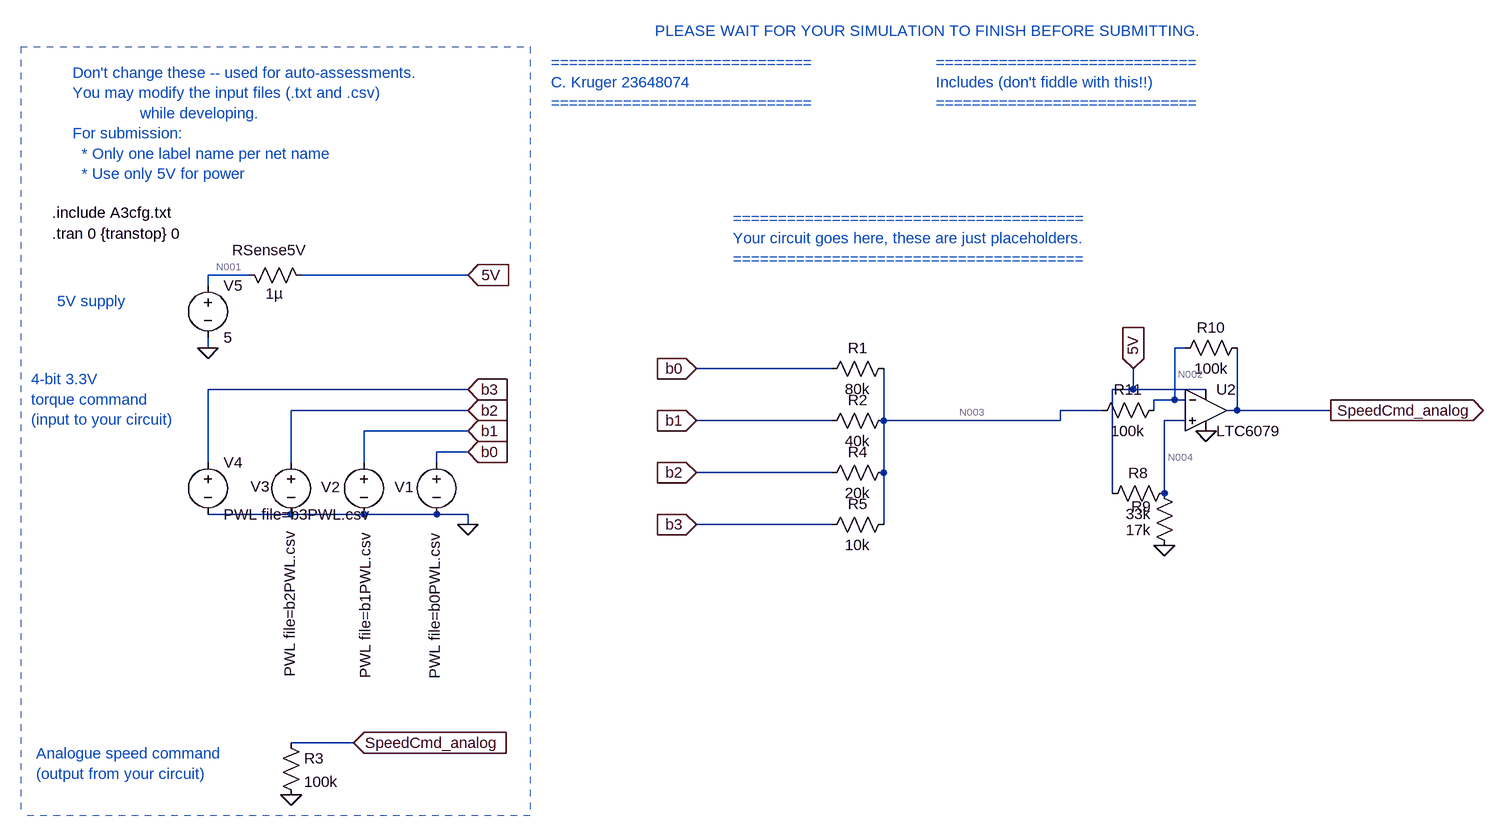
[diagram p0: schematic E344_23648074_A3.asc]
E344_23648074_A3.asc, the LTspice schematic file:
Version 4
SHEET 1 1824 2192
WIRE -2016 -1072 -2080 -1072
WIRE -1680 -1072 -1936 -1072
WIRE -2080 -1056 -2080 -1072
WIRE -2080 -960 -2080 -976
WIRE -576 -960 -592 -960
WIRE -1120 -928 -1328 -928
WIRE -1680 -896 -2080 -896
WIRE -656 -896 -656 -928
WIRE -656 -896 -688 -896
WIRE -544 -896 -656 -896
WIRE -592 -880 -592 -960
WIRE -592 -880 -624 -880
WIRE -576 -880 -592 -880
WIRE -1680 -864 -1952 -864
WIRE -704 -864 -768 -864
WIRE -624 -864 -624 -880
WIRE -496 -864 -496 -960
WIRE -496 -864 -512 -864
WIRE -352 -864 -496 -864
WIRE -1120 -848 -1328 -848
WIRE -1040 -848 -1040 -928
WIRE -768 -848 -768 -864
WIRE -768 -848 -1040 -848
WIRE -576 -848 -608 -848
WIRE -1680 -832 -1840 -832
WIRE -1680 -800 -1728 -800
WIRE -2080 -784 -2080 -896
WIRE -1952 -784 -1952 -864
WIRE -1840 -784 -1840 -832
WIRE -1728 -784 -1728 -800
WIRE -1120 -768 -1328 -768
WIRE -1040 -768 -1040 -848
WIRE -688 -736 -688 -896
WIRE -608 -736 -608 -848
WIRE -1952 -704 -2080 -704
WIRE -1840 -704 -1952 -704
WIRE -1728 -704 -1840 -704
WIRE -1680 -704 -1728 -704
WIRE -1680 -688 -1680 -704
WIRE -1120 -688 -1328 -688
WIRE -1040 -688 -1040 -768
WIRE -1856 -352 -1952 -352
FLAG -1680 -1072 5V
IOPIN -1680 -1072 In
FLAG -2080 -960 0
FLAG -656 -928 5V
IOPIN -656 -928 In
FLAG -352 -864 SpeedCmd_analog
IOPIN -352 -864 Out
FLAG -1680 -688 0
FLAG -1680 -896 b3
IOPIN -1680 -896 In
FLAG -1680 -864 b2
IOPIN -1680 -864 In
FLAG -1680 -832 b1
IOPIN -1680 -832 In
FLAG -1680 -800 b0
IOPIN -1680 -800 In
FLAG -1328 -688 b3
IOPIN -1328 -688 In
FLAG -1328 -768 b2
IOPIN -1328 -768 In
FLAG -1328 -848 b1
IOPIN -1328 -848 In
FLAG -1328 -928 b0
IOPIN -1328 -928 In
FLAG -1856 -352 SpeedCmd_analog
IOPIN -1856 -352 In
FLAG -1952 -272 0
FLAG -544 -832 0
FLAG -608 -656 0
SYMBOL voltage -2080 -1072 R0
WINDOW 123 0 0 Left 0
WINDOW 39 0 0 Left 0
SYMATTR InstName V5
SYMATTR Value 5
SYMBOL res -2032 -1088 M90
WINDOW 0 -7 47 VBottom 2
WINDOW 3 29 54 VTop 2
SYMATTR InstName RSense5V
SYMATTR Value 1µ
SYMBOL voltage -1728 -800 R0
WINDOW 3 -3 125 VRight 2
WINDOW 123 0 0 Left 0
WINDOW 39 0 0 Left 0
WINDOW 0 -65 54 Left 2
SYMATTR Value PWL file=b0PWL.csv
SYMATTR InstName V1
SYMBOL voltage -1840 -800 R0
WINDOW 3 2 124 VRight 2
WINDOW 123 0 0 Left 0
WINDOW 39 0 0 Left 0
WINDOW 0 -66 54 Left 2
SYMATTR Value PWL file=b1PWL.csv
SYMATTR InstName V2
SYMBOL voltage -1952 -800 R0
WINDOW 3 -2 122 VRight 2
WINDOW 123 0 0 Left 0
WINDOW 39 0 0 Left 0
WINDOW 0 -62 53 Left 2
SYMATTR Value PWL file=b2PWL.csv
SYMATTR InstName V3
SYMBOL res -1968 -368 R0
SYMATTR InstName R3
SYMATTR Value 100k
SYMBOL res -1024 -944 R90
WINDOW 0 0 56 VBottom 2
WINDOW 3 32 56 VTop 2
SYMATTR InstName R1
SYMATTR Value 80k
SYMBOL res -1024 -864 R90
WINDOW 0 0 56 VBottom 2
WINDOW 3 32 56 VTop 2
SYMATTR InstName R2
SYMATTR Value 40k
SYMBOL res -1024 -784 R90
WINDOW 0 0 56 VBottom 2
WINDOW 3 32 56 VTop 2
SYMATTR InstName R4
SYMATTR Value 20k
SYMBOL res -1024 -704 R90
WINDOW 0 0 56 VBottom 2
WINDOW 3 32 56 VTop 2
SYMATTR InstName R5
SYMATTR Value 10k
SYMBOL OpAmps\\LTC6079 -544 -864 R0
SYMATTR InstName U2
SYMBOL res -592 -752 R90
WINDOW 0 0 56 VBottom 2
WINDOW 3 32 56 VTop 2
SYMATTR InstName R8
SYMATTR Value 33k
SYMBOL res -592 -640 R180
WINDOW 0 36 76 Left 2
WINDOW 3 36 40 Left 2
SYMATTR InstName R9
SYMATTR Value 17k
SYMBOL res -480 -976 R90
WINDOW 0 0 56 VBottom 2
WINDOW 3 32 56 VTop 2
SYMATTR InstName R10
SYMATTR Value 100k
SYMBOL res -608 -880 R90
WINDOW 0 0 56 VBottom 2
WINDOW 3 32 56 VTop 2
SYMATTR InstName R11
SYMATTR Value 100k
SYMBOL voltage -2080 -800 R0
WINDOW 123 0 0 Left 0
WINDOW 39 0 0 Left 0
SYMATTR InstName V4
SYMATTR Value PWL file=b3PWL.csv
TEXT -2288 -1384 Left 2 ;Don't change these -- used for auto-assessments.\nYou may modify the input files (.txt and .csv) \n               while developing.\nFor submission: \n  * Only one label name per net name\n  * Use only 5V for power
TEXT -1552 -1400 Left 2 ;=============================\nC. Kruger 23648074\n=============================
TEXT -960 -1400 Left 2 ;=============================\nIncludes (don't fiddle with this!!)\n=============================
TEXT -1272 -1160 Left 2 ;=======================================\nYour circuit goes here, these are just placeholders.\n=======================================
TEXT -1392 -1448 Left 2 ;PLEASE WAIT FOR YOUR SIMULATION TO FINISH BEFORE SUBMITTING.
TEXT -2320 -1136 Left 2 !.tran 0 {transtop} 0
TEXT -2320 -1168 Left 2 !.include A3cfg.txt
TEXT -2312 -1032 Left 2 ;5V supply
TEXT -2352 -912 Left 2 ;4-bit 3.3V\ntorque command\n(input to your circuit)
TEXT -2344 -336 Left 2 ;Analogue speed command\n(output from your circuit)
LINE Normal -1584 -1424 -1584 -240 2
LINE Normal -2368 -1424 -1584 -1424 2
LINE Normal -1584 -240 -2368 -240 2
LINE Normal -1584 -256 -1584 -256 2
LINE Normal -2368 -1424 -2368 -240 2

The netlist it stands for:
* E344_23648074_A3.asc
V5 N001 0 5
RSense5V N001 5V 1µ
V1 b0 0 PWL file=b0PWL.csv
V2 b1 0 PWL file=b1PWL.csv
V3 b2 0 PWL file=b2PWL.csv
R3 SpeedCmd_analog 0 100k
R1 N003 b0 80k
R2 N003 b1 40k
R4 N003 b2 20k
R5 N003 b3 10k
XU2 N004 N002 5V 0 SpeedCmd_analog LTC6078  ; LTC6079, pins In+ In- V+ V- OUT
R8 N004 5V 33k
R9 0 N004 17k
R10 SpeedCmd_analog N002 100k
R11 N002 N003 100k
V4 b3 0 PWL file=b3PWL.csv
* Don't change these -- used for auto-assessments.
* You may modify the input files (.txt and .csv)
*                while developing.
* For submission:
*   * Only one label name per net name
*   * Use only 5V for power
* =============================
* C. Kruger 23648074
* =============================
* =============================
* Includes (don't fiddle with this!!)
* =============================
* =======================================
* Your circuit goes here, these are just placeholders.
* =======================================
* PLEASE WAIT FOR YOUR SIMULATION TO FINISH BEFORE SUBMITTING.
.tran 0 {transtop} 0
.include A3cfg.txt
* 5V supply
* 4-bit 3.3V
* torque command
* (input to your circuit)
* Analogue speed command
* (output from your circuit)
.lib LTC5.lib
.backanno
.end

* Results of the author's LTspice run, read from the files saved beside the schematic
* Operating Point, zero values left out:
*   V(n001) = 5 V
*   V(5v) = 5 V
*   V(speedcmd_analog) = 3.314 V
*   V(n003) = 86.08 mV
*   V(n004) = 1.7 V
*   V(n002) = 1.7 V
*   I(R11) = 16.14 µA
*   I(R10) = 16.14 µA
*   I(R9) = -100 µA
*   I(R8) = -100 µA
*   I(R5) = 8.608 µA
*   I(R4) = 4.304 µA
*   I(R2) = 2.152 µA
*   I(R1) = 1.076 µA
*   I(R3) = 33.14 µA
*   I(Rsense5v) = 189.9 µA
*   I(V4) = 8.608 µA
*   I(V3) = 4.304 µA
*   I(V2) = 2.152 µA
*   I(V1) = 1.076 µA
*   I(V5) = -189.9 µA
*   Ix(u2:3) = 89.87 µA
*   Ix(u2:4) = -40.6 µA
*   Ix(u2:5) = -49.28 µA
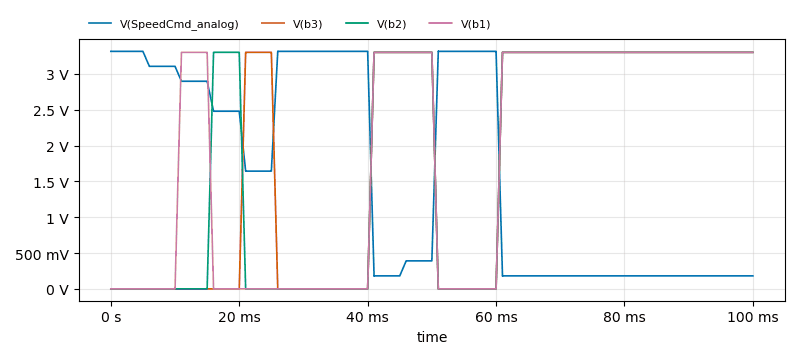
[diagram p1: Transient Analysis of E344_23648074_A3.asc, plotted from the saved traces]
* Transient Analysis, 1 run:
*   V(SpeedCmd_analog): min 179.2 mV, max 3.316 V, average 1.617 V, rms 2.16 V, last 181 mV
*   V(b3): min 0 V, max 3.3 V, average 1.798 V, rms 2.42 V, last 3.3 V
*   V(b2): min 0 V, max 3.3 V, average 1.798 V, rms 2.421 V, last 3.3 V
*   V(b1): min 0 V, max 3.3 V, average 1.798 V, rms 2.421 V, last 3.3 V